# EAGLE design TeamB_PDS (EAGLE 7.1.0)
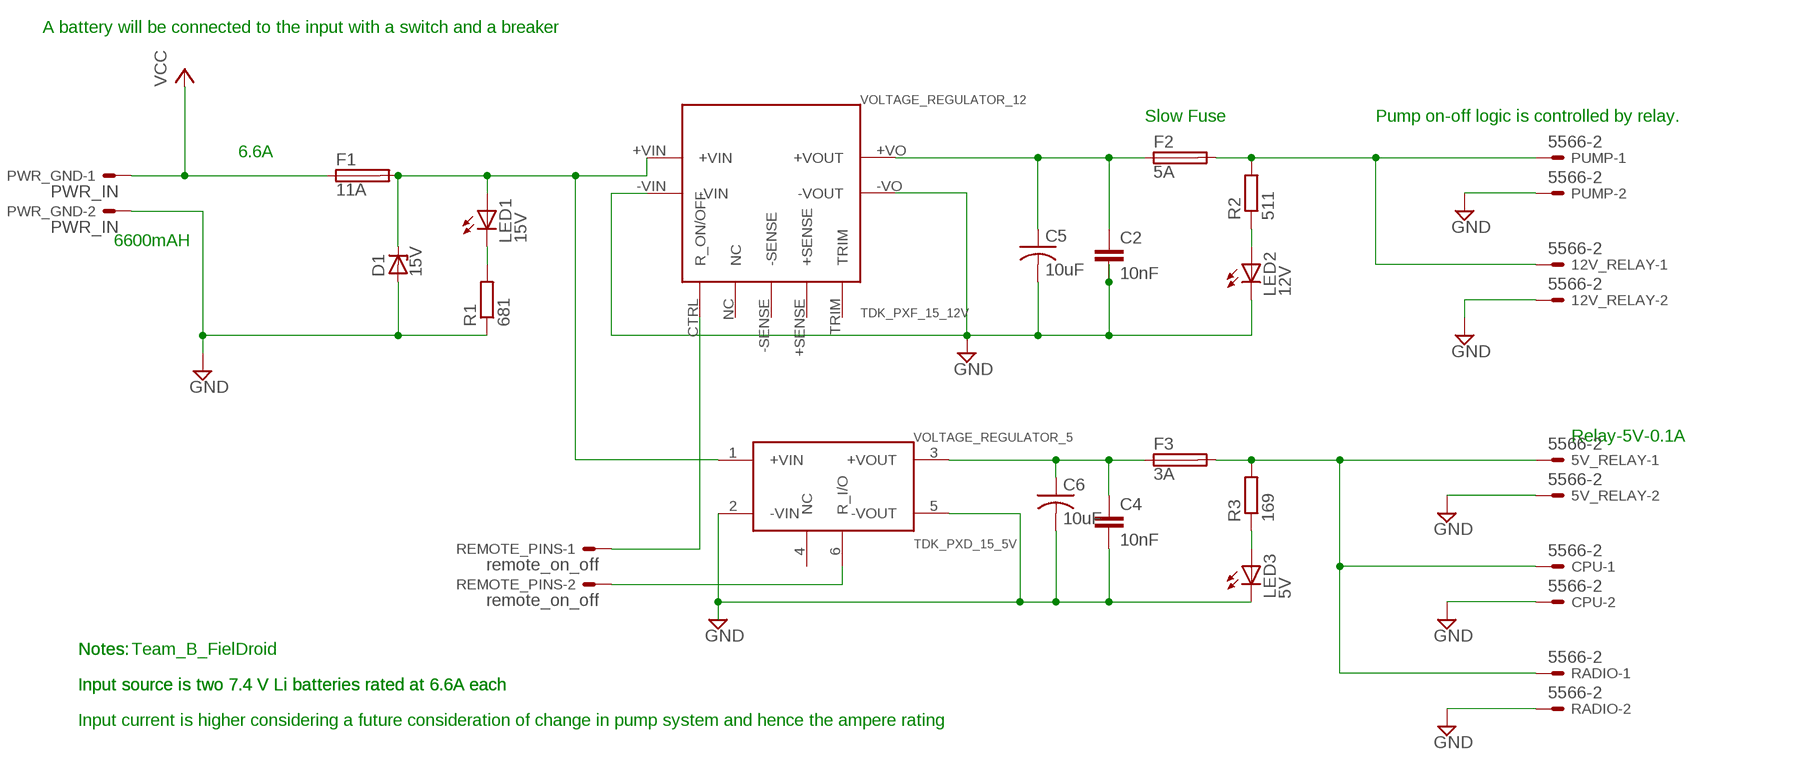
[diagram p0: schematic, sheet 1]

## Parts
5V_RELAY  5566-2  [5566-2]
12V_RELAY  5566-2  [5566-2]
C2  10nF  C2.5/4  [C2.5-4]
C4  10nF  C2.5/4  [C2.5-4]
C5  10uF  C-US050-024X044  [C050-024X044]
C6  10uF  C-US050-024X044  [C050-024X044]
CPU  5566-2  [5566-2]
D1  15V  ZENER-DIODEZD-5  [ZDIO-5]
F1  11A  SH25  [SH25]
F2  5A  SH25  [SH25]
F3  3A  SH25  [SH25]
LED1  15V  LED5MM  [LED5MM]
LED2  12V  LED5MM  [LED5MM]
LED3  5V  LED5MM  [LED5MM]
PUMP  5566-2  [5566-2]
PWR_GND  PWR_IN  5566-2  [5566-2]
R1  681  R-EU_0204/7  [0204/7]
R2  511  R-EU_0204/7  [0204/7]
R3  169  R-EU_0204/7  [0204/7]
RADIO  5566-2  [5566-2]
REMOTE_PINS  remote_on_off  5566-2  [5566-2]
VOLTAGE_REGULATOR_5  TDK_PXD_15_5V  [TDK-PXD_15-5V]
VOLTAGE_REGULATOR_12  TDK_PXF_15_12V  [TDK_PXF_15_12V]

## Nets
GND: 5V_RELAY.2 12V_RELAY.2 C2.2 C4.2 C5.2 C6.2 CPU.2 D1.A LED2.K(C) LED3.K(C) PUMP.2 PWR_GND.2 R1.1 RADIO.2 VOLTAGE_REGULATOR_5.2(-VIN) VOLTAGE_REGULATOR_5.5(-VOUT) VOLTAGE_REGULATOR_12.-VIN VOLTAGE_REGULATOR_12.-VO(-VOUT)
N$2: D1.C F1.2 LED1.A VOLTAGE_REGULATOR_5.1(+VIN) VOLTAGE_REGULATOR_12.+VIN
N$4: LED1.K(C) R1.2
N$5: C2.1 C5.1 F2.1 VOLTAGE_REGULATOR_12.+VO(+VOUT)
N$6: 12V_RELAY.1 F2.2 PUMP.1 R2.2
N$7: LED2.A R2.1
N$8: REMOTE_PINS.1 VOLTAGE_REGULATOR_12.CTRL(R_ON/OFF)
N$9: REMOTE_PINS.2 VOLTAGE_REGULATOR_5.6(R_I/O)
N$10: C4.1 C6.1 F3.1 VOLTAGE_REGULATOR_5.3(+VOUT)
N$11: 5V_RELAY.1 CPU.1 F3.2 R3.2 RADIO.1
N$12: LED3.A R3.1
VCC: F1.1 PWR_GND.1
Unconnected: VOLTAGE_REGULATOR_5.4(NC) VOLTAGE_REGULATOR_12.+SENSE VOLTAGE_REGULATOR_12.-SENSE VOLTAGE_REGULATOR_12.NC VOLTAGE_REGULATOR_12.TRIM

## Notes on the sheet
- A battery will be connected to the input with a switch and a breaker
- Slow Fuse | Pump on-off logic is controlled by relay.
- 6.6A
- 6600mAH
- Relay-5V-0.1A
- Notes: | Notes: | Team_B_FielDroid
- Input source is two 7.4 V Li batteries rated at 6.6A each | Input source is two 7.4 V Li batteries rated at 6.6A each
- Input current is higher considering a future consideration of change in pump system and hence the ampere rating

## Library data of the parts
5V_RELAY 12V_RELAY CPU PUMP PWR_GND RADIO REMOTE_PINS = con-molex-FD:5566-2: Mini FIT connector 2 pol Source: http://www.molex.com; OC_FARNELL: 1822072; OC_NEWARK: unknown
C2 C4 = capacitor-wima:C: CAPACITOR naming: grid - package width
C5 C6 = rcl:C-US: CAPACITOR, American symbol
D1 = diode:ZENER-DIODE: Z-Diode
F1-F3 = fuse:SH25: FUSE HOLDER grid 25 mm, OGN0031 8211, Schurter (Buerklin); MF: SCHURTER; MPN: 0031.8211; OC_FARNELL: 1162741; OC_NEWARK: 96B9380
LED1-LED3 = led:LED: LED OSRAM: - CHIPLED LG R971, LG N971, LY N971, LG Q971, LY Q971, LO R971, LY R971 LH N974, LH R974 LS Q976, LO Q976, LY Q976 LO Q996 - Hyper CHIPLED LW Q18S LB Q993, LB Q99A, LB R99A - SideLED LS A670, LO A670, LY A670, LG A670, LP A670 LB A673, LV A673, LT A673, LW A673 LH A674 LY A675 LS A676, LA A676, LO A676, LY A676, LW A676 LS A679, LY A679, LG A679 - Hyper Micro SIDELED® LS Y876, LA Y876, LO Y876, LY Y876 LT Y87S - SmartLED LW L88C, LW L88S LB L89C, LB L89S, LG L890 LS L89K, LO L89K, LY L89K LS L896, LA L896, LO L896, LY L896 - TOPLED LS T670, LO T670, LY T670, LG T670, LP T670 LSG T670, LSP T670, LSY T670, LOP T670, LYG T670 LG T671, LOG T671, LSG T671 LB T673, LV T673, LT T673, LW T673 LH T674 LS T676, LA T676, LO T676, LY T676, LB T676, LH T676, LSB T676, LW T676 LB T67C, LV T67C, LT T67C, LS T67K, LO T67K, LY T67K, LW E67C LS E67B, LA E67B, LO E67B, LY E67B, LB E67C, LV E67C, LT E67C LW T67C LS T679, LY T679, LG T679 LS T770, LO T770, LY T770, LG T770, LP T770 LB T773, LV T773, LT T773, LW T773 LH T774 LS E675, LA E675, LY E675, LS T675 LS T776, LA T776, LO T776, LY T776, LB T776 LHGB T686 LT T68C, LB T68C - Hyper Mini TOPLED® LB M676 - Mini TOPLED Santana® LG M470 LS M47K, LO M47K, LY M47K Source: http://www.osram.convergy.de LUXEON: - LUMILED® LXK2-PW12-R00, LXK2-PW12-S00, LXK2-PW14-U00, LXK2-PW14-V00 LXK2-PM12-R00, LXK2-PM12-S00, LXK2-PM14-U00 LXK2-PE12-Q00, LXK2-PE12-R00, LXK2-PE12-S00, LXK2-PE14-T00, LXK2-PE14-U00 LXK2-PB12-K00, LXK2-PB12-L00, LXK2-PB12-M00, LXK2-PB14-N00, LXK2-PB14-P00, LXK2-PB14-Q00 LXK2-PR12-L00, LXK2-PR12-M00, LXK2-PR14-Q00, LXK2-PR14-R00 LXK2-PD12-Q00, LXK2-PD12-R00, LXK2-PD12-S00 LXK2-PH12-R00, LXK2-PH12-S00 LXK2-PL12-P00, LXK2-PL12-Q00, LXK2-PL12-R00 Source: www.luxeon.com KINGBRIGHT: KA-3528ASYC Source: www.kingbright.com
R1-R3 = rcl:R-EU_: RESISTOR, European symbol
VOLTAGE_REGULATOR_5 = TeamB_Task11:TDK_PXD_15_5V
VOLTAGE_REGULATOR_12 = TeamB_Task11:TDK_PXF_15_12V

## Board
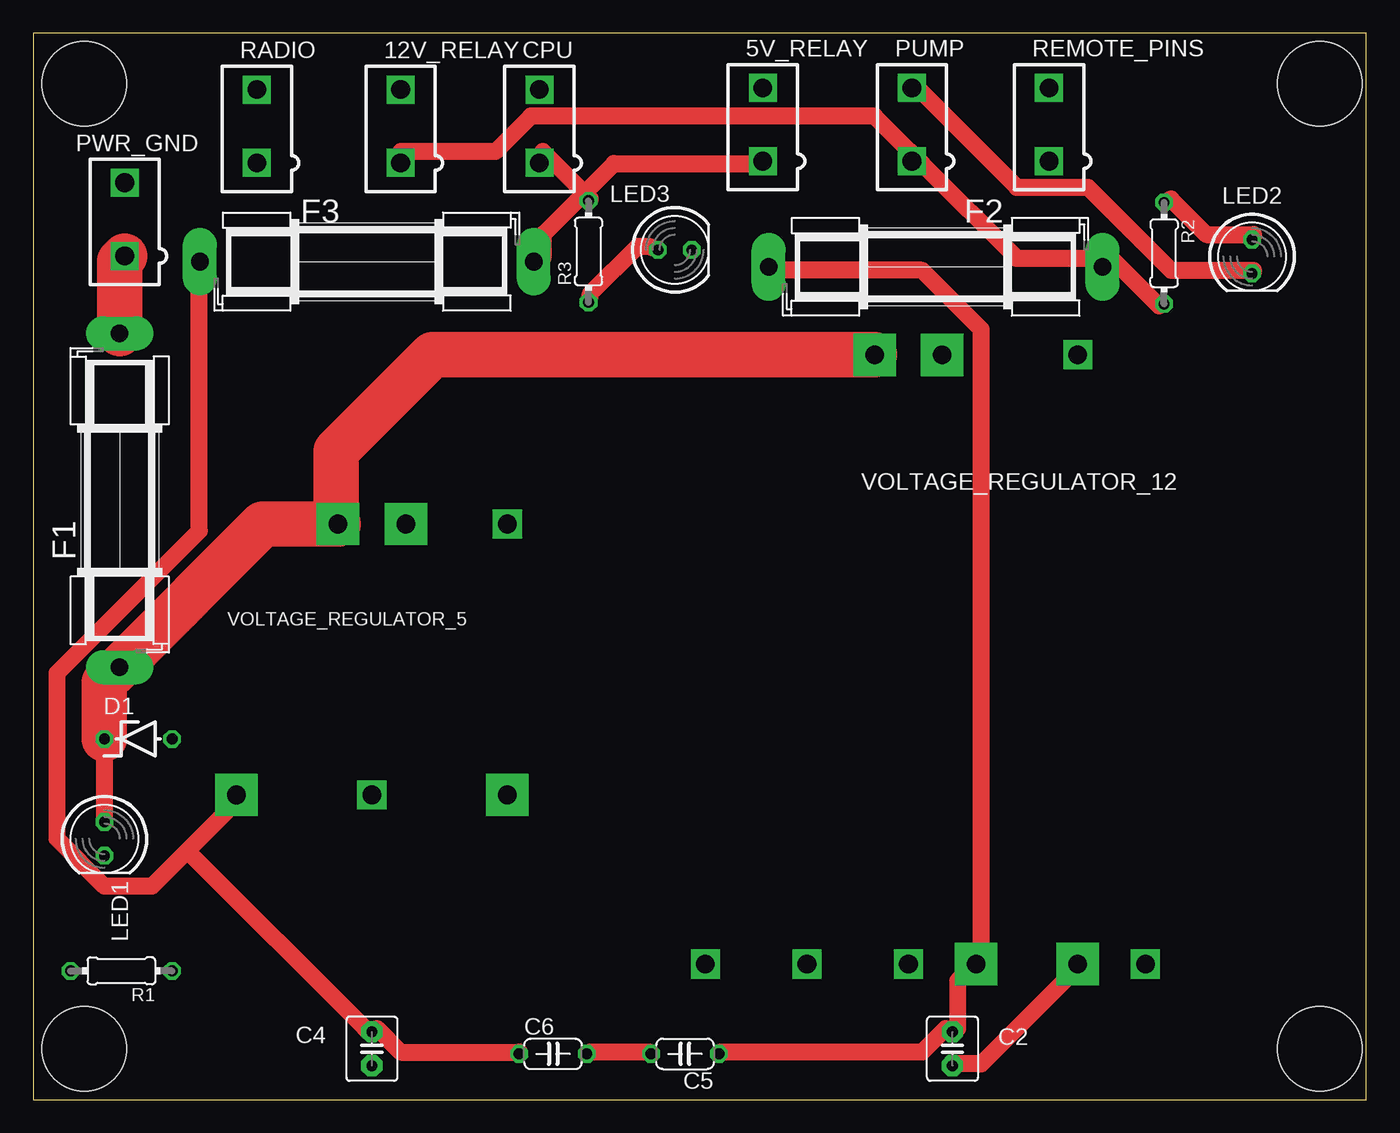
[diagram p1: board, top side]
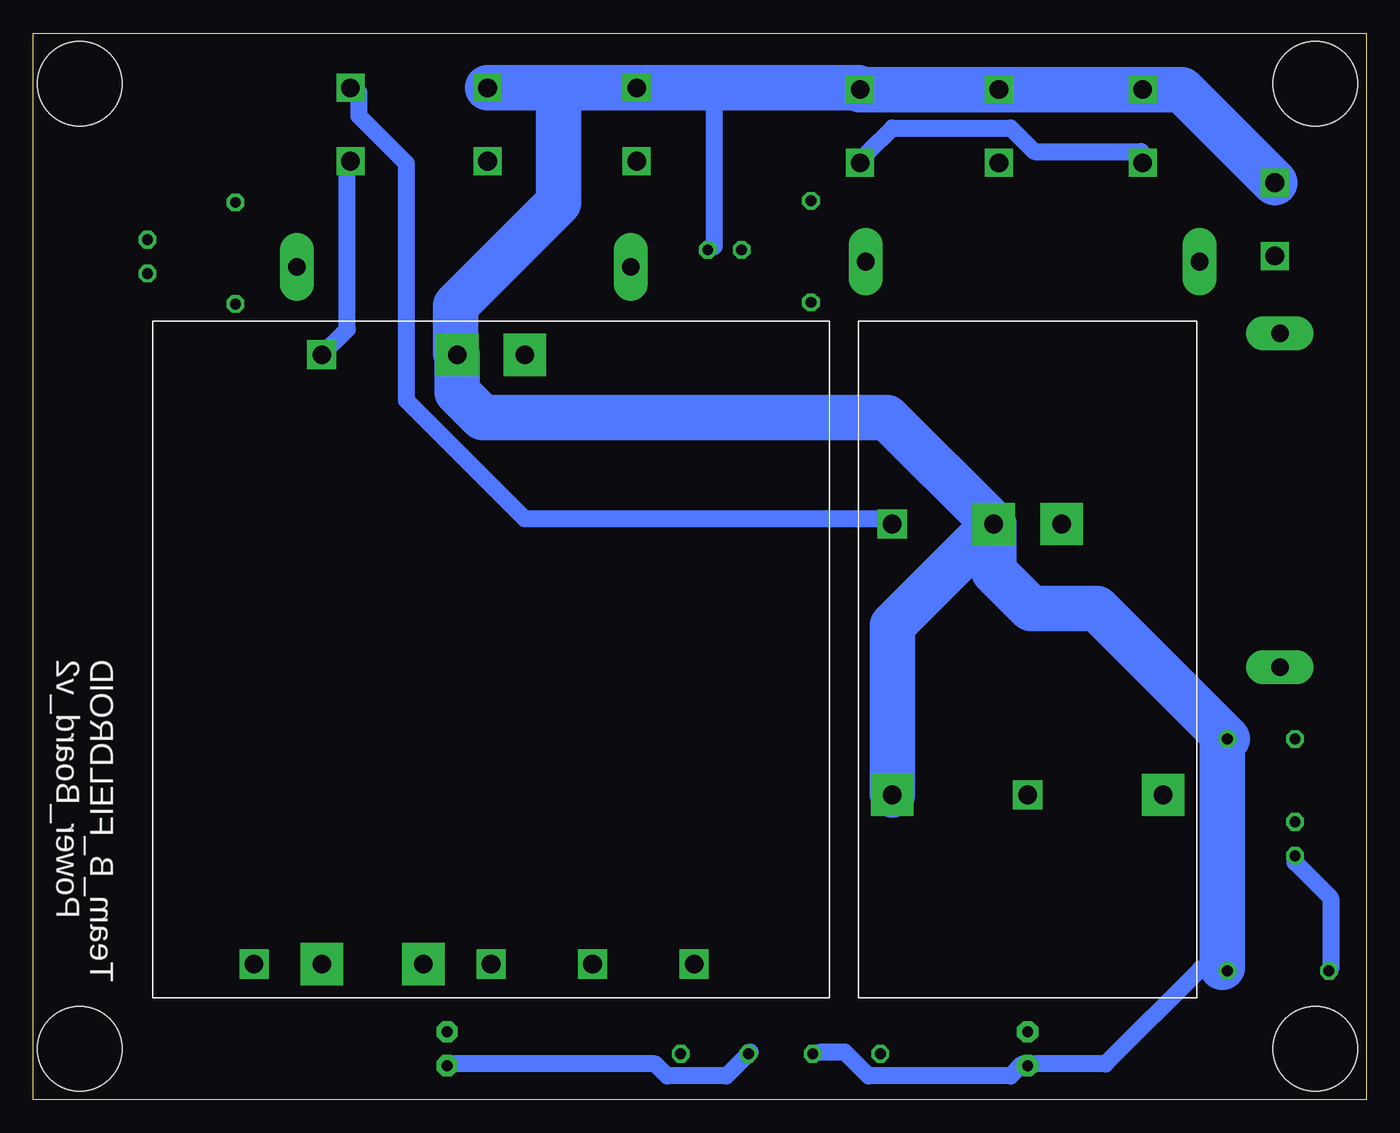
[diagram p2: board, bottom side, seen from below]

Size 100 x 80 mm. Coordinates in mm from the lower left corner, seen from the top.
Outline: 0,0 100,0 100,80 0,80 0,0
Copper layers (1*16): Top 0.035mm / dielectric 1.5mm / Bottom 0.035mm
Design rules "default *": minimum track width 50mil, minimum drill 24mil, track to track 20mil, track to pad 8mil, pad to pad 8mil, via to via 8mil, smd to smd 8mil, copper to edge 40mil, drill to drill 8mil, minimum pad ring 10mil, minimum via ring 8mil, stop-mask expansion 4mil, vias tented up to drill 0mil, thermal gap 10mil
Holes 6.35 mm at 3.81,76.2 96.52,76.2 96.52,3.81 3.81,3.81

### Footprints (pad centres in the part's own frame; a part is rotated, then mirrored left to right if it is on the bottom)
5566-2 = drill 1.4 square: 1 0,-2.75; 2 0,2.75
C2.5-4 = drill 0.813 pad 1.6 octagon: 1 -1.27,0; 2 1.27,0
C050-024X044 = drill 0.813 octagon: 1 -2.54,0; 2 2.54,0
ZDIO-5 = drill 0.813 octagon: A 2.54,0; C -2.54,0
SH25 = drill 1.321 pad 2.54 long: 1 -12.522,0; 2 12.522,0
LED5MM = drill 0.813 octagon: A -1.27,0; K 1.27,0
0204/7 = drill 0.813 octagon: 1 -3.81,0; 2 3.81,0
TDK-PXD_15-5V = drill 1.4 pad 3.175 square: 1 -2.54,10.16; 2 2.54,10.16; 3 -10.16,-10.16; 5 10.16,-10.16 | drill 1.4 pad 2.184 square: 4 0,-10.16; 6 10.16,10.16
TDK_PXF_15_12V = drill 1.4 pad 2.184 square: +SENSE -1.27,-19.05; -SENSE -8.89,-19.05; CTRL 11.43,26.67; NC -16.51,-19.05; TRIM 16.51,-19.05 | drill 1.4 pad 3.175 square: +VIN -3.81,26.67; +VO 3.81,-19.05; -VIN 1.27,26.67; -VO 11.43,-19.05

### Placement (x,y rotation side)
5V_RELAY  54.74,73.15 0 top
12V_RELAY  27.56,73.03 0 top
C2  68.96,3.81 270 top
C4  25.4,3.81 270 top
C5  48.9,3.43 180 top
C6  38.99,3.43 0 top
CPU  37.97,73.03 0 top
D1  7.87,27.05 0 top
F1  6.48,44.96 270 top
F2  67.69,62.48 0 top
F3  25.02,62.87 0 top
LED1  5.33,19.56 270 top
LED2  91.44,63.25 270 top
LED3  48.13,63.75 0 top
PUMP  65.91,73.15 0 top
PWR_GND  6.86,66.04 0 top
R1  6.6,9.65 180 top
R2  84.84,63.5 270 top
R3  41.66,63.63 90 top
RADIO  16.76,73.03 0 top
REMOTE_PINS  76.2,73.15 0 top
VOLTAGE_REGULATOR_5  25.4,33.02 0 top
VOLTAGE_REGULATOR_12  66.93,29.21 0 top

### Tracks (layer width: path | path; a pad name or v marks a point on that pad's centre or on a via)
GND
  Top 1.27: C2.2 69.34,2.67 71.12,2.67 78.23,9.78 VOLTAGE_REGULATOR_12.-VO | C6.2 41.78,3.56 46.23,3.56 C5.2 | LED2.K 91.57,62.23 85.34,62.23 79.12,68.45 73.79,68.45 66.67,75.56 PUMP.2
  Bottom 1.27: R1.1 10.67,9.78 10.79,9.91 12.45,9.78 19.56,2.67 24.89,2.67 C4.2 25.78,2.67 26.67,1.78 37.34,1.78 39.12,3.56 40.89,3.56 C6.2 | 48.9,75.9 48.9,64.01 LED3.K | C2.2 68.45,2.67 53.34,2.67 52.45,1.78 48.01,1.78 C5.2 46.23,3.56
  Bottom 3.429: PWR_GND.2 13.84,75.78 RADIO.2 12V_RELAY.2 CPU.2 38.1,75.9 48.9,75.9 5V_RELAY.2 60.58,75.9 | 60.58,75.9 PUMP.2 | VOLTAGE_REGULATOR_5.2 35.56,35.56 VOLTAGE_REGULATOR_5.5 | VOLTAGE_REGULATOR_5.2 27.94,39.62 25.15,36.83 20.19,36.83 D1.A 10.79,26.67 10.79,9.91 | 60.58,75.9 60.58,67.31 68.33,59.56 68.33,56.01 VOLTAGE_REGULATOR_12.-VIN 68.2,53.09 66.29,51.18 35.94,51.18 VOLTAGE_REGULATOR_5.2
N$2
  Top 1.27: D1.C LED1.A
  Top 3.429: D1.C 5.33,31.29 F1.2 17.22,43.18 VOLTAGE_REGULATOR_5.1 22.73,43.31 22.73,48.64 29.97,55.88 VOLTAGE_REGULATOR_12.+VIN
N$4
  Bottom 1.27: R1.2 2.67,9.78 2.67,15.11 5.33,17.78 LED1.K
N$5
  Top 1.27: C5.1 51.56,3.56 66.67,3.56 68.45,5.33 C2.1 69.34,5.33 69.34,8.89 70.23,9.78 VOLTAGE_REGULATOR_12.+VO 71.12,10.67 71.12,57.78 66.67,62.23 56.01,62.23 F2.1
N$6
  Top 1.27: R2.2 84.45,59.56 80.9,63.12 F2.2 80.01,63.12 73.79,63.12 66.67,70.23 PUMP.1 65.79,71.12 63.12,73.79 37.34,73.79 34.67,71.12 27.56,71.12 12V_RELAY.1
N$7
  Top 1.27: LED2.A 91.57,64.9 88.01,64.9 85.34,67.56 R2.1
N$8
  Bottom 1.27: VOLTAGE_REGULATOR_12.CTRL 76.45,57.78 76.45,70.23 REMOTE_PINS.1
N$9
  Bottom 1.27: REMOTE_PINS.2 75.56,75.56 75.56,73.79 72.01,70.23 72.01,52.45 63.12,43.56 35.56,43.56 VOLTAGE_REGULATOR_5.6
N$10
  Top 1.27: C6.1 36.45,3.56 27.56,3.56 25.78,5.33 C4.1 24.89,5.33 11.56,18.67 | 11.56,18.67 15.11,22.23 VOLTAGE_REGULATOR_5.3 | 11.56,18.67 8.89,16 5.33,16 1.78,19.56 1.78,32 12.45,42.67 12.45,62.23 F3.1
N$11
  Top 1.27: 41.34,68.01 38.23,71.12 CPU.1 | 41.34,68.01 41.78,67.56 R3.2 | 41.34,68.01 43.56,70.23 54.23,70.23 5V_RELAY.1 | 41.34,68.01 38.23,64.9 38.23,63.12 F3.2
  Bottom 1.27: RADIO.1 16.89,71.12 24.89,71.12 26.67,72.9 35.56,72.9 37.34,71.12 CPU.1
N$12
  Top 1.27: R3.1 41.78,60.45 45.34,64.01 46.23,64.01 LED3.A
VCC
  Top 3.429: PWR_GND.1 6.48,62.91 F1.1

### Text on the board
bNames: Team_B_FIELDROID | Power_Board_v2